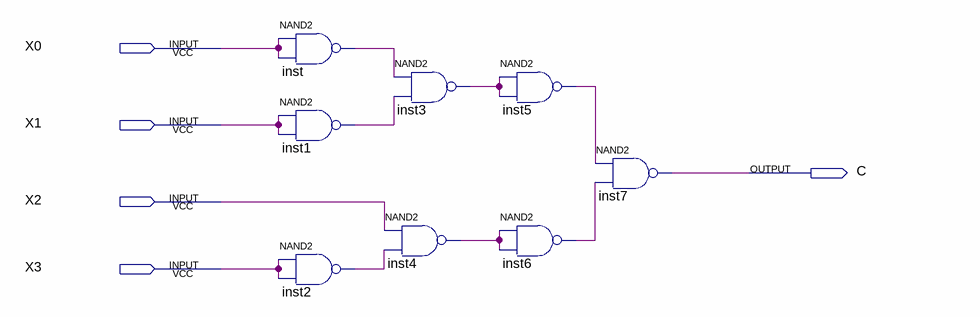
[diagram p0: schematic sheet]
// Quartus schematic cSegmentExapmleScheme.bdf as structural Verilog: 8 symbols, 5 pins
module cSegmentExapmleScheme (
  input  X0,
  input  X1,
  input  X2,
  input  X3,
  output C
);

  wire inst1_out, inst2_out, inst3_out, inst4_out, inst5_out, inst6_out, inst_out;

  nand inst (inst_out, X0, X0);
  nand inst1 (inst1_out, X1, X1);
  nand inst2 (inst2_out, X3, X3);
  nand inst3 (inst3_out, inst_out, inst1_out);
  nand inst4 (inst4_out, X2, inst2_out);
  nand inst5 (inst5_out, inst3_out, inst3_out);
  nand inst6 (inst6_out, inst4_out, inst4_out);
  nand inst7 (C, inst5_out, inst6_out);
endmodule
